# EAGLE schematic siren (EAGLE 7.5.0)
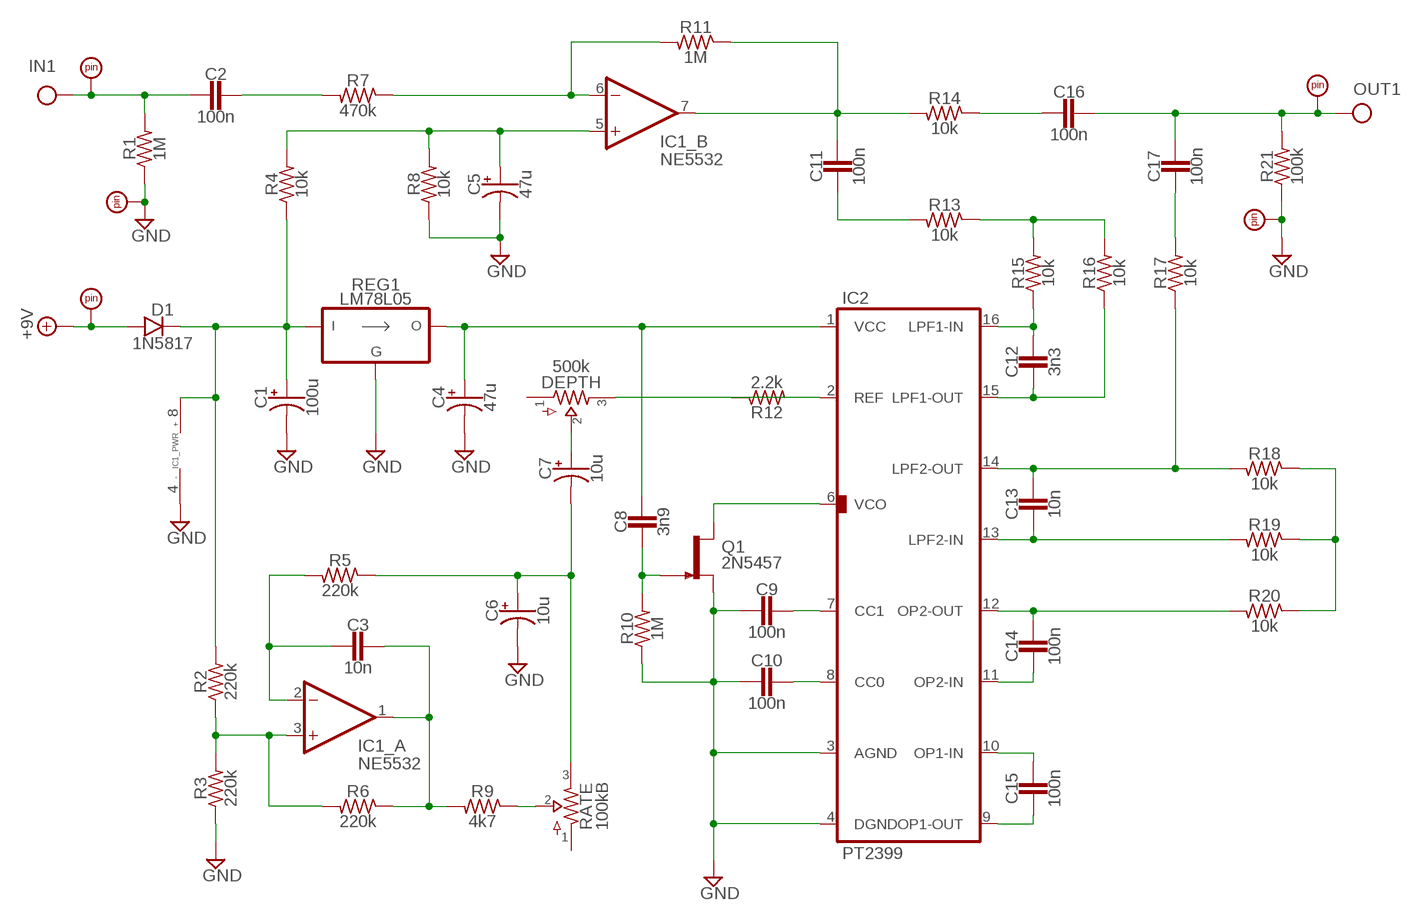
[diagram p0: schematic, sheet 1]

## Parts
C1  100u  0501  [050_020_1]
C2  100n  CER/FILMBOX.1  [BOX_SMALL]
C3  10n  CER/FILMBOX.1  [BOX_SMALL]
C4  47u  0501  [050_020_1]
C5  47u  0501  [050_020_1]
C6  10u  0501  [050_020_1]
C7  10u  0501  [050_020_1]
C8  3n9  CER/FILMBOX.1  [BOX_SMALL]
C9  100n  CER/FILMBOX.1  [BOX_SMALL]
C10  100n  CER/FILMBOX.1  [BOX_SMALL]
C11  100n  CER/FILMBOX.1  [BOX_SMALL]
C12  3n3  CER/FILMBOX.1  [BOX_SMALL]
C13  10n  CER/FILMBOX.1  [BOX_SMALL]
C14  100n  CER/FILMBOX.1  [BOX_SMALL]
C15  100n  CER/FILMBOX.1  [BOX_SMALL]
C16  100n  CER/FILMBOX.1  [BOX_SMALL]
C17  100n  CER/FILMBOX.1  [BOX_SMALL]
D1  1N5817  DO41.2  [DO41-2]
DEPTH  500k  POTSTRIM  [2262_TRIM]
IC1  NE5532  DUALTH  [DIL08]
IC2  PT2399  PT2399TH  [DIL16]
PAD1  PADSQR  [SQUARE]
PAD2  PADSQR  [SQUARE]
PAD3  PADRND  [ROUND]
PAD4  PADRND  [ROUND]
PAD5  PADSQR  [SQUARE]
Q1  2N5457  [TO92-]
R1  1M  R_.2  [R0207/2V]
R2  220k  R_.2  [R0207/2V]
R3  220k  R_.2  [R0207/2V]
R4  10k  R_.2  [R0207/2V]
R5  220k  R_.2  [R0207/2V]
R6  220k  R_.2  [R0207/2V]
R7  470k  R_.2  [R0207/2V]
R8  10k  R_.2  [R0207/2V]
R9  4k7  R_.2  [R0207/2V]
R10  1M  R_.2  [R0207/2V]
R11  1M  R_.2  [R0207/2V]
R12  2.2k  R_.2  [R0207/2V]
R13  10k  R_.2  [R0207/2V]
R14  10k  R_.2  [R0207/2V]
R15  10k  R_.2  [R0207/2V]
R16  10k  R_.2  [R0207/2V]
R17  10k  R_.2  [R0207/2V]
R18  10k  R_.2  [R0207/2V]
R19  10k  R_.2  [R0207/2V]
R20  10k  R_.2  [R0207/2V]
R21  100k  R_.2  [R0207/2V]
RATE  100kB  POTSSMALL_PADS  [PADS_SMALL]
REG1  LM78L05  [TO92-]

## Nets
+9V: D1.A PAD2.1
GND: C1.- C4.- C5.- C6.- C9.2 C10.2 IC1.4(_PWR:V-) IC2.3(AGND) IC2.4(DGND) PAD3.1 PAD4.1 Q1.2(S) R1.1 R3.1 R8.1 R10.1 R21.1 REG1.2(GND)
IN: C2.2 PAD1.1 R1.2
N$1: C12.1 IC2.16(LPF1-IN) R15.1
N$2: C12.2 IC2.15(LPF1-OUT) R16.1
N$3: DEPTH.3 R12.2
N$4: R13.1 R15.2 R16.2
N$5: C13.1 IC2.14(LPF2-OUT) R17.1 R18.2
N$6: C14.1 IC2.12(OP2-OUT) R20.2
N$7: C13.2 IC2.13(LPF2-IN) R19.2
N$8: R18.1 R19.1 R20.1
N$9: C14.2 IC2.11(OP2-IN)
N$10: C15.1 IC2.10(OP1-IN)
N$11: C15.2 IC2.9(OP1-OUT)
N$12: C17.2 R17.2
N$13: C16.2 R14.1
N$14: C11.1 IC1.7(_B:OUT) R11.1 R14.2
N$15: IC1.6(_B:-IN) R7.1 R11.2
N$16: C2.1 R7.2
N$17: C11.2 R13.2
N$18: C5.+ IC1.5(_B:+IN) R4.2 R8.2
N$19: C4.+ C8.1 IC2.1(VCC) REG1.3(VO)
N$20: IC2.2(REF) R12.1
N$21: IC2.6(VCO) Q1.3(D)
N$22: C7.+ DEPTH.2
N$23: C9.1 IC2.7(CC1)
N$24: C10.1 IC2.8(CC0)
N$25: IC1.3(_A:+IN) R2.1 R3.2 R6.2
N$26: C3.2 IC1.2(_A:-IN) R5.2
N$28: C6.+ C7.- R5.1 RATE.3
N$29: R9.1 RATE.2
N$30: C3.1 IC1.1(_A:OUT) R6.1 R9.2
N$31: C8.2 Q1.1(G) R10.2
N$32: C1.+ D1.C IC1.8(_PWR:V+) R2.2 R4.1 REG1.1(VI)
OUT: C16.1 C17.1 PAD5.1 R21.2
Unconnected: DEPTH.1 RATE.1

## Library data of the parts
C1 C4-C7 = capacitors-elec:050: 0.22 - 100uF Xicon values at Mouser.com: 10V: 10 - 100uF; 16V: 2.2 - 47uF; 25V: 0.47 - 47uF; 50V: 0.22 - 22uF
C2 C3 C8-C17 = capacitors-film:CER/FILM: 47 - 120pF Xicon Ceramic Disc 2.5mm lead spacing
D1 = diodes:DO41: DO-41 Package Diodes: 1N4001 - 1N40019 Zener Diodes: 1N4728 - 1N4764
DEPTH RATE = potentiometers:POTS
IC1 = integrated circuits:DUAL: OP AMP
IC2 = integrated circuits:PT2399: Echo Processor IC
PAD1-PAD5 = supply pins:PAD
Q1 = transistors:2N5457: N-CHANNEL JFET
R1-R21 = resistors:R_
REG1 = regulators:LM78L05